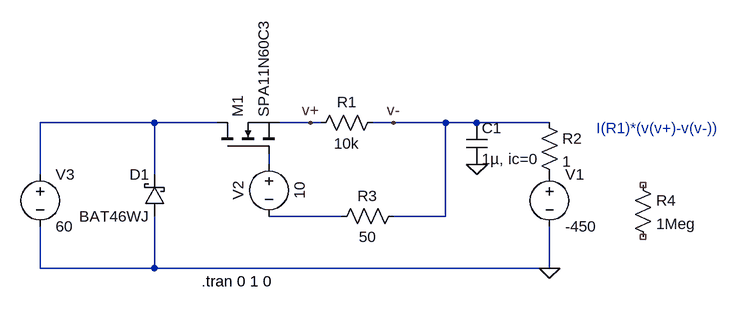
[diagram p0: schematic Draft3.asc]
Draft3.asc, the LTspice schematic file:
Version 4
SHEET 1 880 680
WIRE -160 80 -336 80
WIRE -64 80 -160 80
WIRE 80 80 32 80
WIRE 96 80 80 80
WIRE 208 80 176 80
WIRE 288 80 208 80
WIRE 336 80 288 80
WIRE 448 80 336 80
WIRE 16 144 16 128
WIRE -336 160 -336 80
WIRE -160 160 -160 80
WIRE 128 224 16 224
WIRE 288 224 288 80
WIRE 288 224 208 224
WIRE -336 304 -336 240
WIRE -160 304 -160 224
WIRE -160 304 -336 304
WIRE 448 304 448 240
WIRE 448 304 -160 304
FLAG 448 304 0
FLAG 80 80 v+
FLAG 208 80 v-
FLAG 336 144 0
SYMBOL schottky -144 224 R180
WINDOW 0 24 64 Left 2
WINDOW 3 24 0 Left 2
SYMATTR InstName D1
SYMATTR Value BAT46WJ
SYMATTR Description Diode
SYMATTR Type diode
SYMBOL res 80 96 R270
WINDOW 0 32 56 VTop 2
WINDOW 3 0 56 VBottom 2
SYMATTR InstName R1
SYMATTR Value 10k
SYMBOL res 432 64 R0
SYMATTR InstName R2
SYMATTR Value 1
SYMBOL nmos -64 128 R270
SYMATTR InstName M1
SYMATTR Value SPA11N60C3
SYMBOL voltage 16 128 R0
WINDOW 0 -32 56 VBottom 2
WINDOW 3 32 56 VTop 2
WINDOW 123 0 0 Left 0
WINDOW 39 0 0 Left 0
SYMATTR InstName V2
SYMATTR Value 10
SYMBOL res 224 208 R90
WINDOW 0 0 56 VBottom 2
WINDOW 3 32 56 VTop 2
SYMATTR InstName R3
SYMATTR Value 50
SYMBOL voltage -336 144 R0
WINDOW 123 0 0 Left 0
WINDOW 39 0 0 Left 0
SYMATTR InstName V3
SYMATTR Value 60
SYMBOL cap 320 80 R0
SYMATTR InstName C1
SYMATTR Value 1µ, ic=0
SYMBOL voltage 448 144 R0
WINDOW 123 0 0 Left 0
WINDOW 39 0 0 Left 0
SYMATTR InstName V1
SYMATTR Value -450
SYMBOL res 576 160 R0
SYMATTR InstName R4
SYMATTR Value 1Meg
TEXT -88 324 Left 2 !.tran 0 1 0
TEXT 520 88 Left 2 ;I(R1)*(v(v+)-v(v-))

The netlist it stands for:
* Draft3.asc
D1 0 N001 BAT46WJ
R1 v+ v- 10k
R2 v- P001 1
M1 N001 N002 v+ v+ SPA11N60C3
V2 N002 N003 10
R3 v- N003 50
V3 N001 0 60
C1 v- 0 1µ, ic=0
V1 P001 0 -450
R4 NC_01 NC_02 1Meg
.model D D
.lib standard.dio
.model NMOS NMOS
.model PMOS PMOS
.lib standard.mos
.tran 0 1 0
* I(R1)*(v(v+)-v(v-))
.backanno
.end